# Altium schematic sheet 12VDC.SchDoc
size A; SheetNumber: 3; SheetTotal: 4
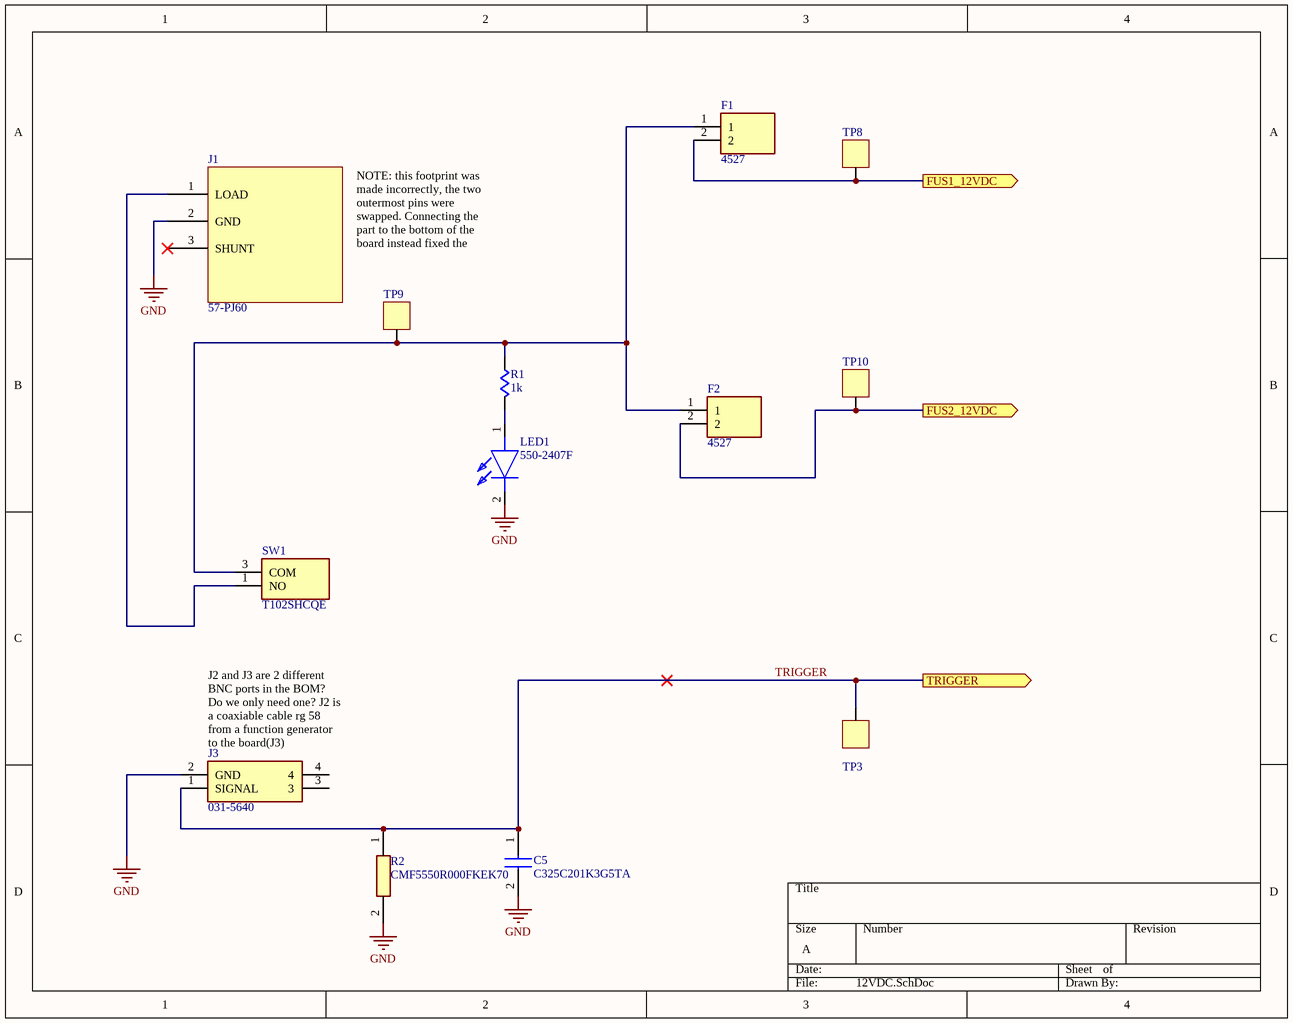
[diagram p0: 12VDC.SchDoc]

## Parts
C5  C325C201K3G5TA  [C325C201K3G5TA]
F1  4527  [4527]
F2  4527  [4527]
J1  57-PJ60  [57-PJ60]
J3  031-5640  [031-5640]
LED1  550-2407F  [5502407F]
R1  1k  [CMF551K0000FKR6]
R2  CMF5550R000FKEK70  [RESAD1526W69L610D229]
SW1  T102SHCQE  [T102SHCQE]
TP3  5261  [5261]  (value not drawn)
TP8  5261  [5261]  (value not drawn)
TP9  5261  [5261]  (value not drawn)
TP10  5261  [5261]  (value not drawn)

## Ports
FUS1_12VDC (out), FUS2_12VDC (out), TRIGGER (out)

## Nets
GND: C5.2 J1.2(GND) J3.2(GND) LED1.2(K) R2.2
FUS1_12VDC: F1.2 TP8.1 ; port FUS1_12VDC
FUS2_12VDC: F2.2 TP10.1 ; port FUS2_12VDC
TRIGGER: C5.1 J3.1(SIGNAL) R2.1 TP3.1 ; port TRIGGER
NetF1_1: F1.1 F2.1 R1.1 SW1.3(COM) TP9.1
NetJ1_1: J1.1(LOAD) SW1.1(NO)
NetLED1_1: LED1.1(A) R1.2

Not connected (* = marked no-connect by the designer): J1 3(SHUNT)*; J3 3 4

## Notes on the sheet
- NOTE: this footprint was made incorrectly, the two outermost pins were swapped. Connecting the part to the bottom of the board instead fixed the issue in hardware.
- (near J3) J2 and J3 are 2 different BNC ports in the BOM? Do we only need one? J2 is a coaxiable cable rg 58 from a function generator to the board(J3)

## Library data of the parts
C5 = C325C201K3G5TA: Capacitor 200 pF; Manufacturer_Name: Kemet; Datasheet Link: https://www.kemet.com/specsheet/C325C201K3G5TA; Height: 7.62mm; Manufacturer_Part_Number: C325C201K3G5TA
F1 F2 = 4527: Undefined or Miscellaneous; Manufacturer_Name: Keystone Electronics; Datasheet Link: https://componentsearchengine.com//4527.pdf; Mouser2 Part Number: 534-4527; Mouser2 Price/Stock: https://www.mouser.com/Search/Refine.aspx?Keyword=534-4527; Manufacturer_Part_Number: 4527
J3 = 031-5640: Connector; Manufacturer_Name: Amphenol; Manufacturer_Part_Number: 031-5640-1010; Datasheet Link: https://datasheet.datasheetarchive.com/originals/distributors/Datasheets_SAMA/570beec7961c44031375f59c7939d09c.pdf; Height: 15.9mm
LED1 = 550-2407F: LED; Manufacturer_Name: Dialight; Datasheet Link: https://componentsearchengine.com//550-2407F.pdf; Height: 6.1mm; Mouser2 Part Number: 645-550-2407F; Mouser2 Price/Stock: https://www.mouser.com/Search/Refine.aspx?Keyword=645-550-2407F; Manufacturer_Part_Number: 550-2407F
R1 = CMF551K0000FKR6: Metal Film Resistors - Through Hole 1/2W 1Kohms 1%
R2 = CMF5550R000FKEK70: Resistor 50ohm; Manufacturer_Name: Vishay; Datasheet Link: http://www.vishay.com/docs/31018/cmfind.pdf; Manufacturer_Part_Number: CMF5550R000FKEK70
SW1 = T102SHCQE: Switch; Manufacturer_Name: C & K COMPONENTS; Datasheet Link: https://componentsearchengine.com/Datasheets/1/T102SHCQE.pdf; Height: 23.56mm; Manufacturer_Part_Number: T102SHCQE
TP3 TP8-TP10 = 5261: TEST POINT grabber (BLACK) - MINIATURE